# EAGLE schematic reagnus (EAGLE 9.6.0)
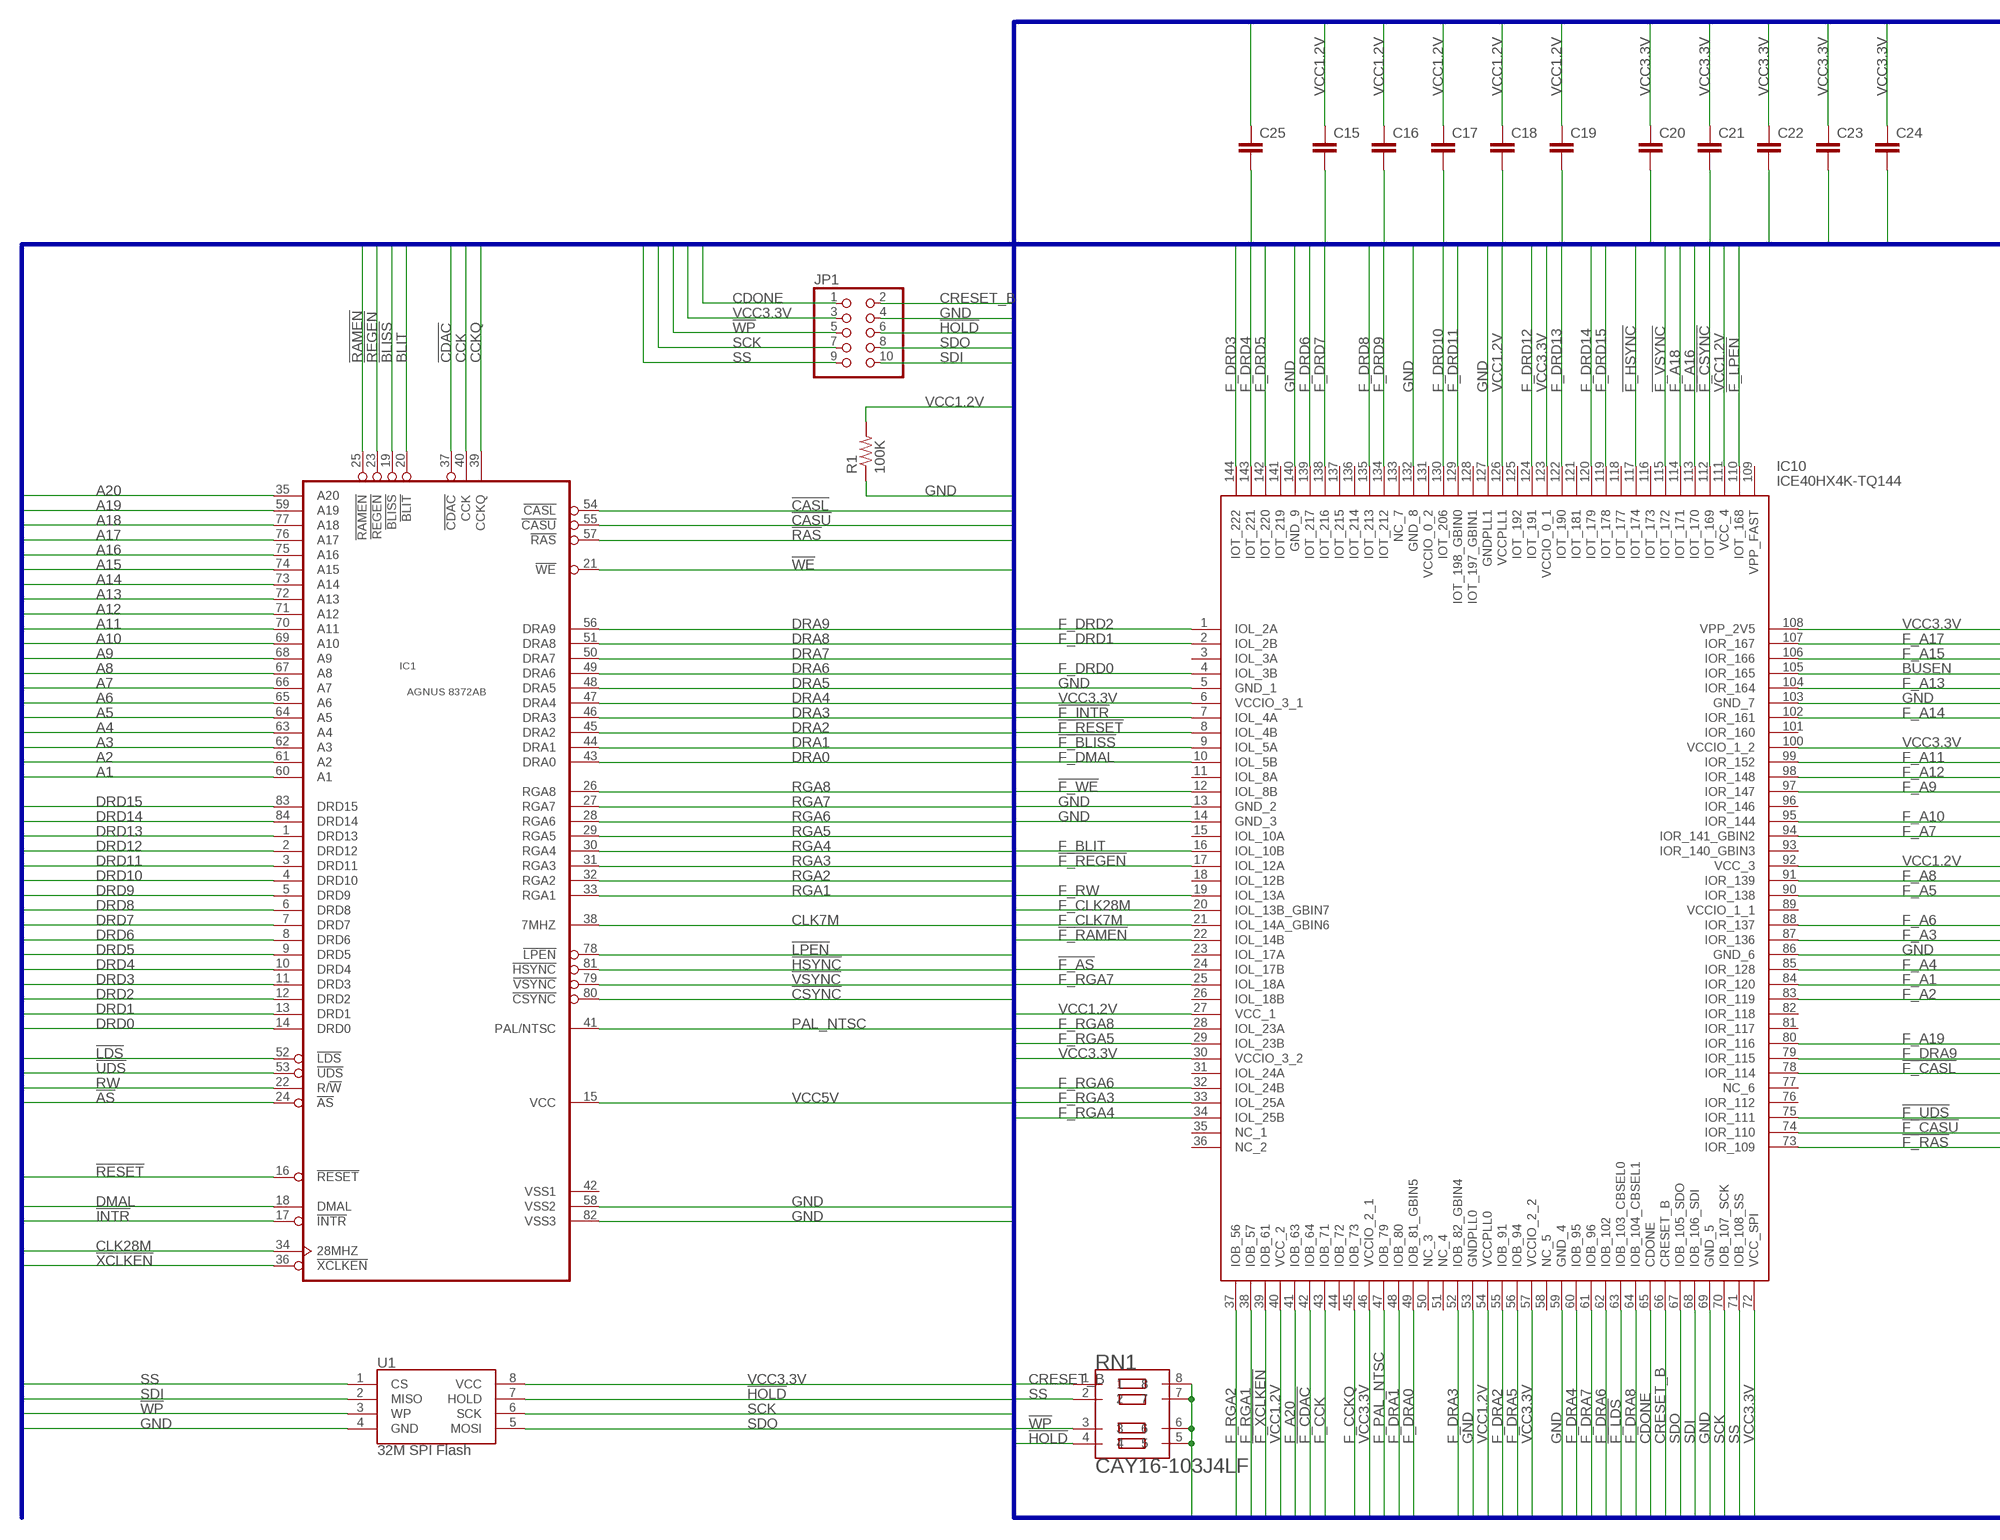
[diagram p0: schematic, sheet 1, part 1 of 2]
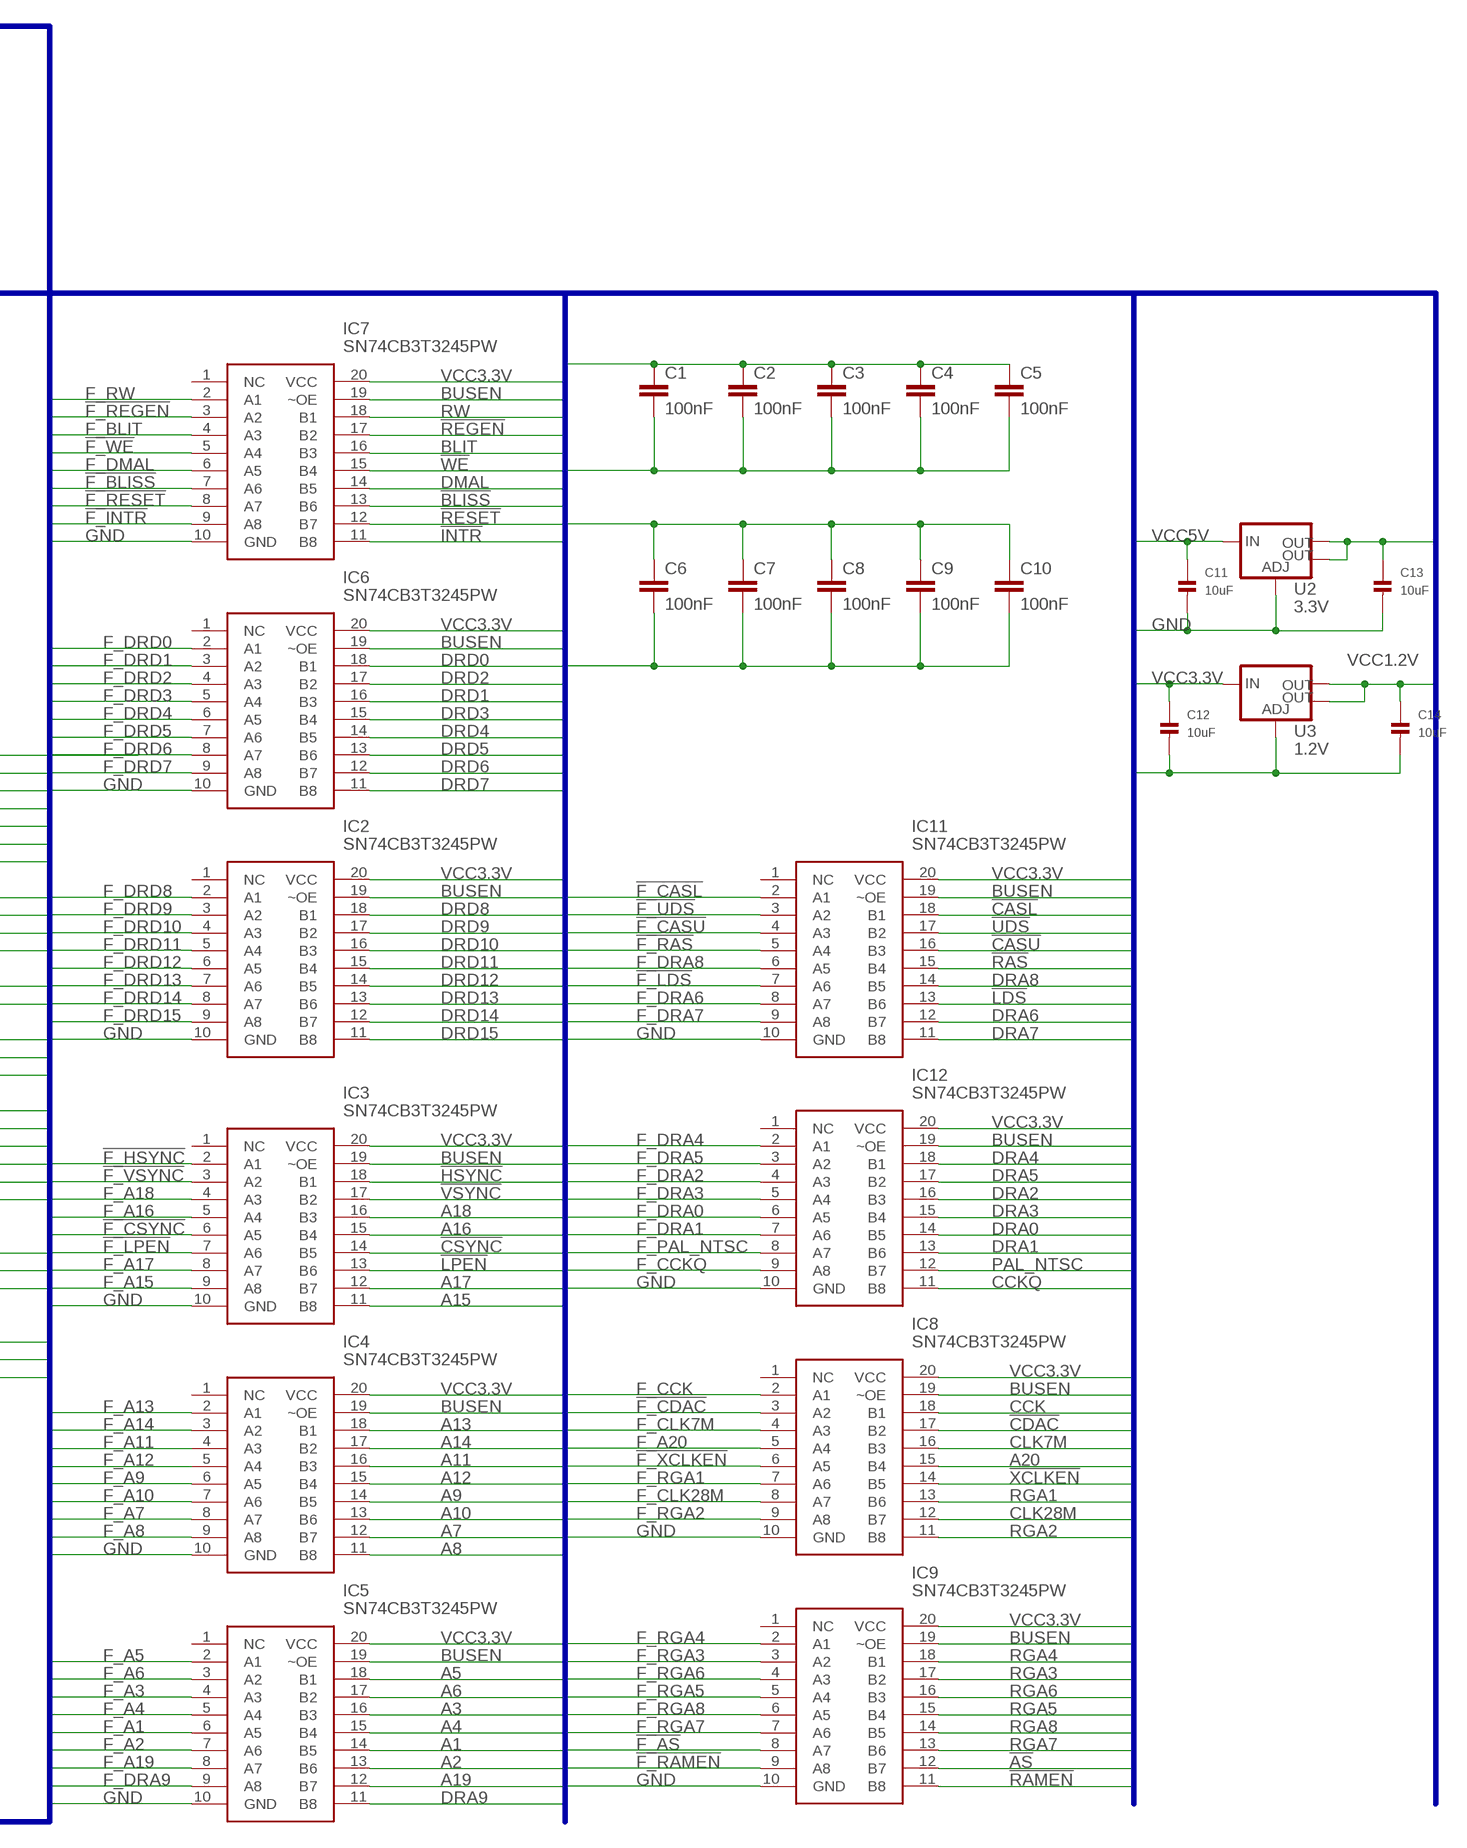
[diagram p1: schematic, sheet 1, part 2 of 2]

## Parts
C1  100nF  C-EUC0805K  [C0805K]
C2  100nF  C-EUC0805K  [C0805K]
C3  100nF  C-EUC0805K  [C0805K]
C4  100nF  C-EUC0805K  [C0805K]
C5  100nF  C-EUC0805K  [C0805K]
C6  100nF  C-EUC0805K  [C0805K]
C7  100nF  C-EUC0805K  [C0805K]
C8  100nF  C-EUC0805K  [C0805K]
C9  100nF  C-EUC0805K  [C0805K]
C10  100nF  C-EUC0805K  [C0805K]
C11  10uF  CAP_CERAMIC1206  [1206]
C12  10uF  CAP_CERAMIC1206  [1206]
C13  10uF  CAP_CERAMIC1206  [1206]
C14  10uF  CAP_CERAMIC1206  [1206]
C15  C-EUC0805K  [C0805K]
C16  C-EUC0805K  [C0805K]
C17  C-EUC0805K  [C0805K]
C18  C-EUC0805K  [C0805K]
C19  C-EUC0805K  [C0805K]
C20  C-EUC0805K  [C0805K]
C21  C-EUC0805K  [C0805K]
C22  C-EUC0805K  [C0805K]
C23  C-EUC0805K  [C0805K]
C24  C-EUC0805K  [C0805K]
C25  C-EUC0805K  [C0805K]
IC1  AGNUS_8372AB_THT  [PLCC84_T]
IC2  SN74CB3T3245PW  [SOP65P640X120-20N]
IC3  SN74CB3T3245PW  [SOP65P640X120-20N]
IC4  SN74CB3T3245PW  [SOP65P640X120-20N]
IC5  SN74CB3T3245PW  [SOP65P640X120-20N]
IC6  SN74CB3T3245PW  [SOP65P640X120-20N]
IC7  SN74CB3T3245PW  [SOP65P640X120-20N]
IC8  SN74CB3T3245PW  [SOP65P640X120-20N]
IC9  SN74CB3T3245PW  [SOP65P640X120-20N]
IC10  ICE40HX4K-TQ144  [QFP50P2200X2200X160-144N]
IC11  SN74CB3T3245PW  [SOP65P640X120-20N]
IC12  SN74CB3T3245PW  [SOP65P640X120-20N]
JP1  HEADER-2X5  [2X05]
R1  100K  R0805  [R0805]
RN1  CAY16-103J4LF  [RESCAXE80P320X160-8N]
U1  32M SPI Flash  SPI_FLASH-X25XXSMD  [SO08]
U2  3.3V  V_REG_LM1117SOT223  [SOT223]
U3  1.2V  V_REG_LM1117SOT223  [SOT223]

## Nets
!AS: IC1.24(!AS) IC9.12(B7)
!BLISS: IC1.19(!BLISS) IC7.13(B6)
!CASL: IC1.54(!CASL) IC11.18(B1)
!CASU: IC1.55(!CASU) IC11.16(B3)
!CDAC: IC1.37(!CDAC) IC8.17(B2)
!CSYNC: IC1.80(!CSYNC) IC3.14(B5)
!F_AS: IC9.8(A7) IC10.24(IOL_17B)
!F_BLISS: IC7.7(A6) IC10.9(IOL_5A)
!F_CASL: IC10.78(IOR_114) IC11.2(A1)
!F_CASU: IC10.74(IOR_110) IC11.4(A3)
!F_CDAC: IC8.3(A2) IC10.42(IOB_64)
!F_CSYNC: IC3.6(A5) IC10.112(IOT_169)
!F_HSYNC: IC3.2(A1) IC10.117(IOT_174)
!F_INTR: IC7.9(A8) IC10.7(IOL_4A)
!F_LDS: IC10.63(IOB_103_CBSEL0) IC11.7(A6)
!F_LPEN: IC3.7(A6) IC10.110(IOT_168)
!F_RAMEN: IC9.9(A8) IC10.22(IOL_14B)
!F_RAS: IC10.73(IOR_109) IC11.5(A4)
!F_REGEN: IC7.3(A2) IC10.17(IOL_12A)
!F_RESET: IC7.8(A7) IC10.8(IOL_4B)
!F_UDS: IC10.75(IOR_111) IC11.3(A2)
!F_VSYNC: IC3.3(A2) IC10.115(IOT_172)
!F_WE: IC7.5(A4) IC10.12(IOL_8B)
!F_XCLKEN: IC8.6(A5) IC10.39(IOB_61)
!HOLD: JP1.6 RN1.4 U1.7(HOLD)
!HSYNC: IC1.81(!HSYNC) IC3.18(B1)
!INTR: IC1.17(!INTR) IC7.11(B8)
!LDS: IC1.52(!LDS) IC11.13(B6)
!LPEN: IC1.78(!LPEN) IC3.13(B6)
!RAMEN: IC1.25(!RAMEN) IC9.11(B8)
!RAS: IC1.57(!RAS) IC11.15(B4)
!REGEN: IC1.23(!REGEN) IC7.17(B2)
!RESET: IC1.16(!RESET) IC7.12(B7)
!UDS: IC1.53(!UDS) IC11.17(B2)
!VSYNC: IC1.79(!VSYNC) IC3.17(B2)
!WE: IC1.21(!WE) IC7.15(B4)
!WP: JP1.5 RN1.3 U1.3(WP)
!XCLKEN: IC1.36(!XCLKEN) IC8.14(B5)
A1: IC1.60(A1) IC5.14(B5)
A2: IC1.61(A2) IC5.13(B6)
A3: IC1.62(A3) IC5.16(B3)
A4: IC1.63(A4) IC5.15(B4)
A5: IC1.64(A5) IC5.18(B1)
A6: IC1.65(A6) IC5.17(B2)
A7: IC1.66(A7) IC4.12(B7)
A8: IC1.67(A8) IC4.11(B8)
A9: IC1.68(A9) IC4.14(B5)
A10: IC1.69(A10) IC4.13(B6)
A11: IC1.70(A11) IC4.16(B3)
A12: IC1.71(A12) IC4.15(B4)
A13: IC1.72(A13) IC4.18(B1)
A14: IC1.73(A14) IC4.17(B2)
A15: IC1.74(A15) IC3.11(B8)
A16: IC1.75(A16) IC3.15(B4)
A17: IC1.76(A17) IC3.12(B7)
A18: IC1.77(A18) IC3.16(B3)
A19: IC1.59(A19) IC5.12(B7)
A20: IC1.35(A20) IC8.15(B4)
BLIT: IC1.20(!BLIT) IC7.16(B3)
BUSEN: IC2.19(~OE) IC3.19(~OE) IC4.19(~OE) IC5.19(~OE) IC6.19(~OE) IC7.19(~OE) IC8.19(~OE) IC9.19(~OE) IC10.105(IOR_165) IC11.19(~OE) IC12.19(~OE)
CCK: IC1.40(CCK) IC8.18(B1)
CCKQ: IC1.39(CCKQ) IC12.11(B8)
CDONE: IC10.65(CDONE) JP1.1
CLK7M: IC1.38(7MHZ) IC8.16(B3)
CLK28M: IC1.34(28MHZ) IC8.12(B7)
CRESET_B: IC10.66(CRESET_B) JP1.2 RN1.1
DMAL: IC1.18(DMAL) IC7.14(B5)
DRA0: IC1.43(DRA0) IC12.14(B5)
DRA1: IC1.44(DRA1) IC12.13(B6)
DRA2: IC1.45(DRA2) IC12.16(B3)
DRA3: IC1.46(DRA3) IC12.15(B4)
DRA4: IC1.47(DRA4) IC12.18(B1)
DRA5: IC1.48(DRA5) IC12.17(B2)
DRA6: IC1.49(DRA6) IC11.12(B7)
DRA7: IC1.50(DRA7) IC11.11(B8)
DRA8: IC1.51(DRA8) IC11.14(B5)
DRA9: IC1.56(DRA9) IC5.11(B8)
DRD0: IC1.14(DRD0) IC6.18(B1)
DRD1: IC1.13(DRD1) IC6.16(B3)
DRD2: IC1.12(DRD2) IC6.17(B2)
DRD3: IC1.11(DRD3) IC6.15(B4)
DRD4: IC1.10(DRD4) IC6.14(B5)
DRD5: IC1.9(DRD5) IC6.13(B6)
DRD6: IC1.8(DRD6) IC6.12(B7)
DRD7: IC1.7(DRD7) IC6.11(B8)
DRD8: IC1.6(DRD8) IC2.18(B1)
DRD9: IC1.5(DRD9) IC2.17(B2)
DRD10: IC1.4(DRD10) IC2.16(B3)
DRD11: IC1.3(DRD11) IC2.15(B4)
DRD12: IC1.2(DRD12) IC2.14(B5)
DRD13: IC1.1(DRD13) IC2.13(B6)
DRD14: IC1.84(DRD14) IC2.12(B7)
DRD15: IC1.83(DRD15) IC2.11(B8)
F_A1: IC5.6(A5) IC10.84(IOR_120)
F_A2: IC5.7(A6) IC10.83(IOR_119)
F_A3: IC5.4(A3) IC10.87(IOR_136)
F_A4: IC5.5(A4) IC10.85(IOR_128)
F_A5: IC5.2(A1) IC10.90(IOR_138)
F_A6: IC5.3(A2) IC10.88(IOR_137)
F_A7: IC4.8(A7) IC10.94(IOR_141_GBIN2)
F_A8: IC4.9(A8) IC10.91(IOR_139)
F_A9: IC4.6(A5) IC10.97(IOR_147)
F_A10: IC4.7(A6) IC10.95(IOR_144)
F_A11: IC4.4(A3) IC10.99(IOR_152)
F_A12: IC4.5(A4) IC10.98(IOR_148)
F_A13: IC4.2(A1) IC10.104(IOR_164)
F_A14: IC4.3(A2) IC10.102(IOR_161)
F_A15: IC3.9(A8) IC10.106(IOR_166)
F_A16: IC3.5(A4) IC10.113(IOT_170)
F_A17: IC3.8(A7) IC10.107(IOR_167)
F_A18: IC3.4(A3) IC10.114(IOT_171)
F_A19: IC5.8(A7) IC10.80(IOR_116)
F_A20: IC8.5(A4) IC10.41(IOB_63)
F_BLIT: IC7.4(A3) IC10.16(IOL_10B)
F_CCK: IC8.2(A1) IC10.43(IOB_71)
F_CCKQ: IC10.45(IOB_73) IC12.9(A8)
F_CLK7M: IC8.4(A3) IC10.21(IOL_14A_GBIN6)
F_CLK28M: IC8.8(A7) IC10.20(IOL_13B_GBIN7)
F_DMAL: IC7.6(A5) IC10.10(IOL_5B)
F_DRA0: IC10.49(IOB_81_GBIN5) IC12.6(A5)
F_DRA1: IC10.48(IOB_80) IC12.7(A6)
F_DRA2: IC10.55(IOB_91) IC12.4(A3)
F_DRA3: IC10.52(IOB_82_GBIN4) IC12.5(A4)
F_DRA4: IC10.60(IOB_95) IC12.2(A1)
F_DRA5: IC10.56(IOB_94) IC12.3(A2)
F_DRA6: IC10.62(IOB_102) IC11.8(A7)
F_DRA7: IC10.61(IOB_96) IC11.9(A8)
F_DRA8: IC10.64(IOB_104_CBSEL1) IC11.6(A5)
F_DRA9: IC5.9(A8) IC10.79(IOR_115)
F_DRD0: IC6.2(A1) IC10.4(IOL_3B)
F_DRD1: IC6.3(A2) IC10.2(IOL_2B)
F_DRD2: IC6.4(A3) IC10.1(IOL_2A)
F_DRD3: IC6.5(A4) IC10.144(IOT_222)
F_DRD4: IC6.6(A5) IC10.143(IOT_221)
F_DRD5: IC6.7(A6) IC10.142(IOT_220)
F_DRD6: IC6.8(A7) IC10.139(IOT_217)
F_DRD7: IC6.9(A8) IC10.138(IOT_216)
F_DRD8: IC2.2(A1) IC10.135(IOT_213)
F_DRD9: IC2.3(A2) IC10.134(IOT_212)
F_DRD10: IC2.4(A3) IC10.130(IOT_206)
F_DRD11: IC2.5(A4) IC10.129(IOT_198_GBIN0)
F_DRD12: IC2.6(A5) IC10.124(IOT_191)
F_DRD13: IC2.7(A6) IC10.122(IOT_190)
F_DRD14: IC2.8(A7) IC10.120(IOT_179)
F_DRD15: IC2.9(A8) IC10.119(IOT_178)
F_PAL_NTSC: IC10.47(IOB_79) IC12.8(A7)
F_RGA1: IC8.7(A6) IC10.38(IOB_57)
F_RGA2: IC8.9(A8) IC10.37(IOB_56)
F_RGA3: IC9.3(A2) IC10.33(IOL_25A)
F_RGA4: IC9.2(A1) IC10.34(IOL_25B)
F_RGA5: IC9.5(A4) IC10.29(IOL_23B)
F_RGA6: IC9.4(A3) IC10.32(IOL_24B)
F_RGA7: IC9.7(A6) IC10.25(IOL_18A)
F_RGA8: IC9.6(A5) IC10.28(IOL_23A)
F_RW: IC7.2(A1) IC10.19(IOL_13A)
GND: C1.2 C2.2 C3.2 C4.2 C5.2 C6.2 C7.2 C8.2 C9.2 C10.2 C11.2 C12.2 C13.2 C14.2 C15.2 C16.2 C17.2 C18.2 C19.2 C20.2 C21.2 C22.2 C23.2 C24.2 C25.2 IC1.58(VSS2) IC1.82(VSS3) IC2.10(GND) IC3.10(GND) IC4.10(GND) IC5.10(GND) IC6.10(GND) IC7.10(GND) IC8.10(GND) IC9.10(GND) IC10.5(GND_1) IC10.13(GND_2) IC10.14(GND_3) IC10.53(GNDPLL0) IC10.59(GND_4) IC10.69(GND_5) IC10.86(GND_6) IC10.103(GND_7) IC10.127(GNDPLL1) IC10.132(GND_8) IC10.140(GND_9) IC11.10(GND) IC12.10(GND) JP1.4 R1.1 U1.4(GND) U2.1(ADJ) U3.1(ADJ)
PAL_NTSC: IC1.41(PAL/NTSC) IC12.12(B7)
RGA1: IC1.33(RGA1) IC8.13(B6)
RGA2: IC1.32(RGA2) IC8.11(B8)
RGA3: IC1.31(RGA3) IC9.17(B2)
RGA4: IC1.30(RGA4) IC9.18(B1)
RGA5: IC1.29(RGA5) IC9.15(B4)
RGA6: IC1.28(RGA6) IC9.16(B3)
RGA7: IC1.27(RGA7) IC9.13(B6)
RGA8: IC1.26(RGA8) IC9.14(B5)
RW: IC1.22(R/!W!) IC7.18(B1)
SCK: IC10.70(IOB_107_SCK) JP1.7 U1.6(SCK)
SDI: IC10.68(IOB_106_SDI) JP1.10 U1.2(MISO)
SDO: IC10.67(IOB_105_SDO) JP1.8 U1.5(MOSI)
SS: IC10.71(IOB_108_SS) JP1.9 RN1.2 U1.1(CS)
VCC1.2V: C14.1 C15.1 C16.1 C17.1 C18.1 C19.1 C25.1 IC10.27(VCC_1) IC10.40(VCC_2) IC10.54(VCCPLL0) IC10.92(VCC_3) IC10.111(VCC_4) IC10.126(VCCPLL1) R1.2 U3.2(OUT) U3.4(OUT)
VCC3.3V: C1.1 C2.1 C3.1 C4.1 C5.1 C6.1 C7.1 C8.1 C9.1 C10.1 C12.1 C13.1 C20.1 C21.1 C22.1 C23.1 C24.1 IC2.20(VCC) IC3.20(VCC) IC4.20(VCC) IC5.20(VCC) IC6.20(VCC) IC7.20(VCC) IC8.20(VCC) IC9.20(VCC) IC10.6(VCCIO_3_1) IC10.30(VCCIO_3_2) IC10.46(VCCIO_2_1) IC10.57(VCCIO_2_2) IC10.72(VCC_SPI) IC10.100(VCCIO_1_2) IC10.108(VPP_2V5) IC10.123(VCCIO_0_1) IC11.20(VCC) IC12.20(VCC) JP1.3 RN1.5 RN1.6 RN1.7 RN1.8 U1.8(VCC) U2.2(OUT) U2.4(OUT) U3.3(IN)
VCC5V: C11.1 IC1.15(VCC) U2.3(IN)
Unconnected: IC2.1(NC) IC3.1(NC) IC4.1(NC) IC5.1(NC) IC6.1(NC) IC7.1(NC) IC8.1(NC) IC9.1(NC) IC10.3(IOL_3A) IC10.11(IOL_8A) IC10.15(IOL_10A) IC10.18(IOL_12B) IC10.23(IOL_17A) IC10.26(IOL_18B) IC10.31(IOL_24A) IC10.35(NC_1) IC10.36(NC_2) IC10.44(IOB_72) IC10.50(NC_3) IC10.51(NC_4) IC10.58(NC_5) IC10.76(IOR_112) IC10.77(NC_6) IC10.81(IOR_117) IC10.82(IOR_118) IC10.89(VCCIO_1_1) IC10.93(IOR_140_GBIN3) IC10.96(IOR_146) IC10.101(IOR_160) IC10.109(VPP_FAST) IC10.116(IOT_173) IC10.118(IOT_177) IC10.121(IOT_181) IC10.125(IOT_192) IC10.128(IOT_197_GBIN1) IC10.131(VCCIO_0_2) IC10.133(NC_7) IC10.136(IOT_214) IC10.137(IOT_215) IC10.141(IOT_219) IC11.1(NC) IC12.1(NC)

## Buses
A[0..20],!AS,!BLISS,BLIT,BUSEN,!CASL,!CASU,CCK,CCKQ,!CDAC,CDONE,CLK7M,CLK28M,CRESET_B,!CSYNC,DMAL,DRA[0..9],DRD[0..15],F_A[1..20],!F_AS,!F_BLISS,F_BLIT,!F_CASL,!F_CASU,F_CCK,F_CCKQ,!F_CDAC,F_CLK7M,F_CLK28M,!F_CSYNC,F_DMAL,F_DRA[0..9],F_DRD[0..15],!F_HSYNC,!F_INTR,!F_LDS,!F_LPEN,F_PAL_NTSC,!F_RAMEN,!F_RAS,!F_REGEN,!F_RESET,F_RGA[1..8],!F_RSYNC,F_RW,!F_UDS,!F_VSYNC,!F_V_SYNC,!F_WE,!F_XCLKEN,GND,!HOLD,!HSYNC,!INTR,!LDS,!LPEN,PAL_NTSC,!RAMEN,!RAS,!REGEN,!RESET,RGA[1..8],!RSYNC,RW,SCK,SDI,SDO,SS,!UDS,VCC1.2V,VCC3.3V,VCC5V,!VSYNC,!V_SYNC,!WE,!WP,!XCLKEN

## Power pins joined to a net without a drawn wire
VSS1: IC1.42(VSS1)

## Library data of the parts
C1-C10 C15-C25 = rcl:C-EU: CAPACITOR, European symbol; SPICEPREFIX: C
C11-C14 = microbuilder:CAP_CERAMIC: Ceramic Capacitors 0402 - 0402 Surface Mount Capacitors 16pF 50V 5% [Digikey: 445-4899-2-ND] 18pF 50V 5% [Digikey: 490-1281-2-ND] 22pF 50V 5% [Digikey: 490-1283-2-ND] 68pF 50V 5% [Digikey: 490-1289-2-ND] 0.1uF 10V 10% [Digikey: 490-1318-2-ND] 1.0uF 6.3V 10% [Digikey: 490-1320-2-ND] 0603 - 0603 Surface Mount Capacitors 16 pF 50V 5% [Digikey: 445-5051-2-ND] 22 pF 50V [Digikey: PCC220ACVTR-ND] 33 pF 50V 5% [Digikey: 490-1415-1-ND] 56pF 50V 5% [Digikey: 490-1421-1-ND] 220pF 50V 5% [Digikey: 445-1285-1-ND] 680 pF 50V 2200 pF 50V 5% C0G [Digikey: 445-1297-1-ND] 5600 pF 100V 5% X7R [Digikey: 478-3711-1-ND] 0.1 µF 25V 10% [Digikey: PCC2277TR-ND] 0.22 µF 16V 10% X7R [Digikey: 445-1318-1-ND] 1.0 µF 25V 10% [Digikey: 445-5146-2-ND] 0603 - RF Specific 3pF 250V +/-0.1pF RF [Digikey: 712-1347-1-ND] 18 pF 250V 5% [Digikey: 478-3505-1-ND or 712-1322-1-ND] 56 pF 250V 5% C0G RF [Digikey: 490-4867-1-ND] 68 pF 250V RF [Digikey: 490-4868-1-ND] 0805 - 0805 Surface Mount Capacitors 220 pF 250V 2% RF Ceramic Capacitor [Digikey: 712-1398-1-ND] 1000 pF 50V 2% NP0 Ceramic Capacitor [Digikey: 478-3760-1-ND] 0.1 µF 25V 10% Ceramic Capacitor [Digikey: PCC1828TR-ND] 1.0 µF 16V 10% Ceramic Capacitor[Digikey: 490-1691-2-ND] 10.0 µF 10V 10% Ceramic Capacitor[Digikey: 709-1228-1-ND] 10.0 uF 16V 10% Ceramic Capacitor [Digikey: 478-5165-2-ND] 47 uF 6.3V 20% Ceramic Capacitor [Digikey: 587-1779-1-ND or 399-5506-1-ND] 1206 - 1206 Surface Mount Capacitors 47uF 10V 20% Ceramic Capacitor [Digikey: 490-5528-1-ND or 399-5508-1-ND or 445-6010-1-ND] 100uF 6.3V -20%, +80% Y5V Ceramic Capacitor (Digikey: 490-4512-1-ND, Mouser: 81-GRM31CF50J107ZE1L)
IC1 = Amiga:AGNUS_8372AB: 8372AB AGNUS (318069-03x) for A3000(T)
IC2-IC9 IC11 IC12 = SN74CB3T3245PW:SN74CB3T3245PW: Texas Instruments SN74CB3T3245PW, Bus Switch, 8 x 1:1, 2.3 3.6 V, 20-Pin TSSOP Source: Datasheet <http://www.ti.com/lit/gpn/SN74CB3T3245>; DESCRIPTION: Texas Instruments SN74CB3T3245PW, Bus Switch, 8 x 1:1, 2.3 3.6 V, 20-Pin TSSOP; HEIGHT: mm; MANUFACTURER_NAME: Texas Instruments; MANUFACTURER_PART_NUMBER: SN74CB3T3245PW; MOUSER_PART_NUMBER: 595-SN74CB3T3245PW; MOUSER_PRICE-STOCK: https://www.mouser.co.uk/ProductDetail/Texas-Instruments/SN74CB3T3245PW?qs=mE33ZKBHyE7%252Bfbhk796%252BPQ%3D%3D
IC10 = tf4060:ICE40HX4K-TQ144: FPGA - Field Programmable Gate Array Source: Datasheet <https://componentsearchengine.com/Datasheets/1/iCE40HX4K-TQ144.pdf>; DESCRIPTION: FPGA - Field Programmable Gate Array; HEIGHT: 1.6mm; MANUFACTURER_NAME: Lattice Semiconductor; MANUFACTURER_PART_NUMBER: iCE40HX4K-TQ144; MOUSER_PART_NUMBER: 842-ICE40HX4K-TQ144; MOUSER_PRICE-STOCK: https://www.mouser.com/Search/Refine.aspx?Keyword=842-ICE40HX4K-TQ144
JP1 = microbuilder:HEADER-2X5: PIN HEADER
R1 = A3660:R0805
RN1 = tf4060:CAY16-103J4LF: Res Thick Film Array 10K Ohm 5% 200ppm/C ISOL Molded 8-Pin 1206(4 X 0603) Convex SMD Paper T/R; AVAILABILITY: Good; DESCRIPTION: Res Thick Film Array 10K Ohm 5% ?200ppm/C ISOL Molded 8-Pin 1206(4 X 0603) Convex SMD Paper T/R; MF: Bourns; MP: CAY16-103J4LF; PACKAGE: 1206 Bourns; PRICE: 0.02 USD
U1 = SparkFun-IC-Memory:SPI_FLASH-X25XX: 32M Serial Flash Memory 8pin SPI Flash series x25xx. Works with devices like W25X32 and BR25L32 Datasheet <http://www.macronix.com/Lists/Datasheet/Attachments/5031/MX25L3206E,%203V,%2032Mb,%20v1.5.pdf> SparkFun Products SparkFun Venus GPS Logger <https://www.sparkfun.com/products/10920> (GPS-10920); PROD_ID: N/A
U2 U3 = SparkFun-IC-Power:V_REG_LM1117: Voltage Regulator LM1117 Standard adjustable voltage regulator but in SMD form. Spark Fun Electronics SKU : COM-00595; PROD_ID: VREG-08170